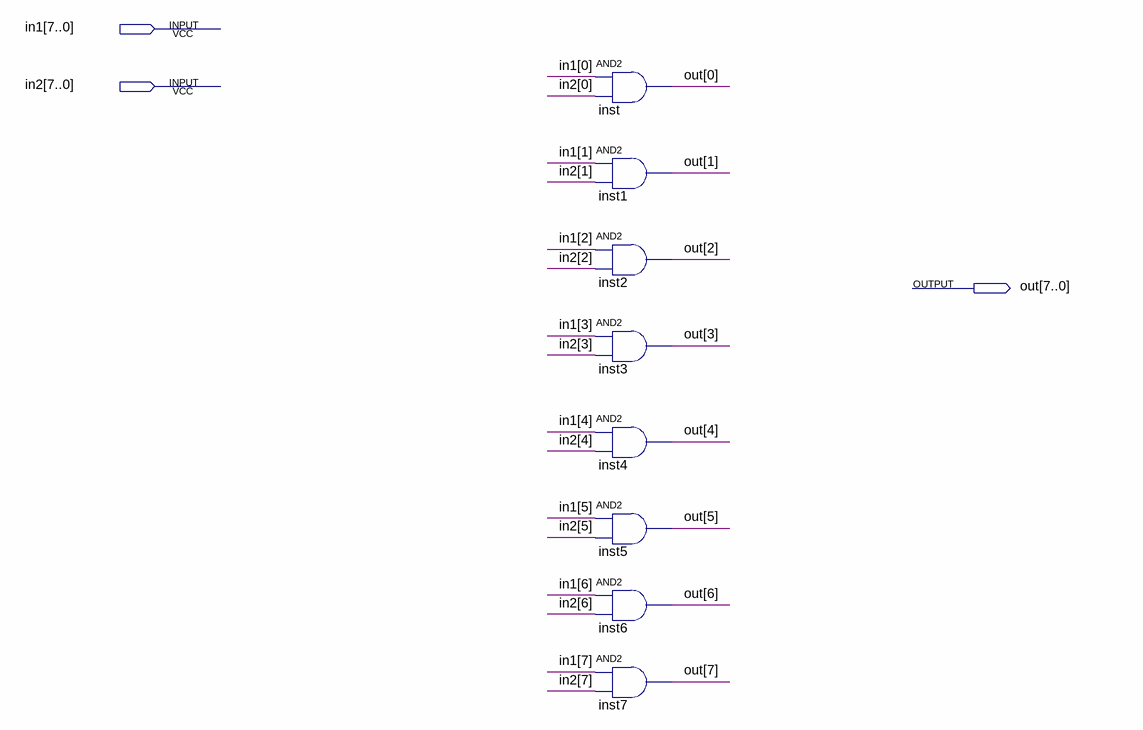
[diagram p0: schematic sheet]
// Quartus schematic ANDByte.bdf as structural Verilog: 8 symbols, 3 pins
module ANDByte (
  input  [7:0] in1,
  input  [7:0] in2,
  output [7:0] out
);

  and inst (out[0], in1[0], in2[0]);
  and inst1 (out[1], in1[1], in2[1]);
  and inst2 (out[2], in1[2], in2[2]);
  and inst3 (out[3], in1[3], in2[3]);
  and inst4 (out[4], in1[4], in2[4]);
  and inst5 (out[5], in1[5], in2[5]);
  and inst6 (out[6], in1[6], in2[6]);
  and inst7 (out[7], in1[7], in2[7]);
endmodule
